# EAGLE design AeroQuad_v20 (EAGLE 5.07)
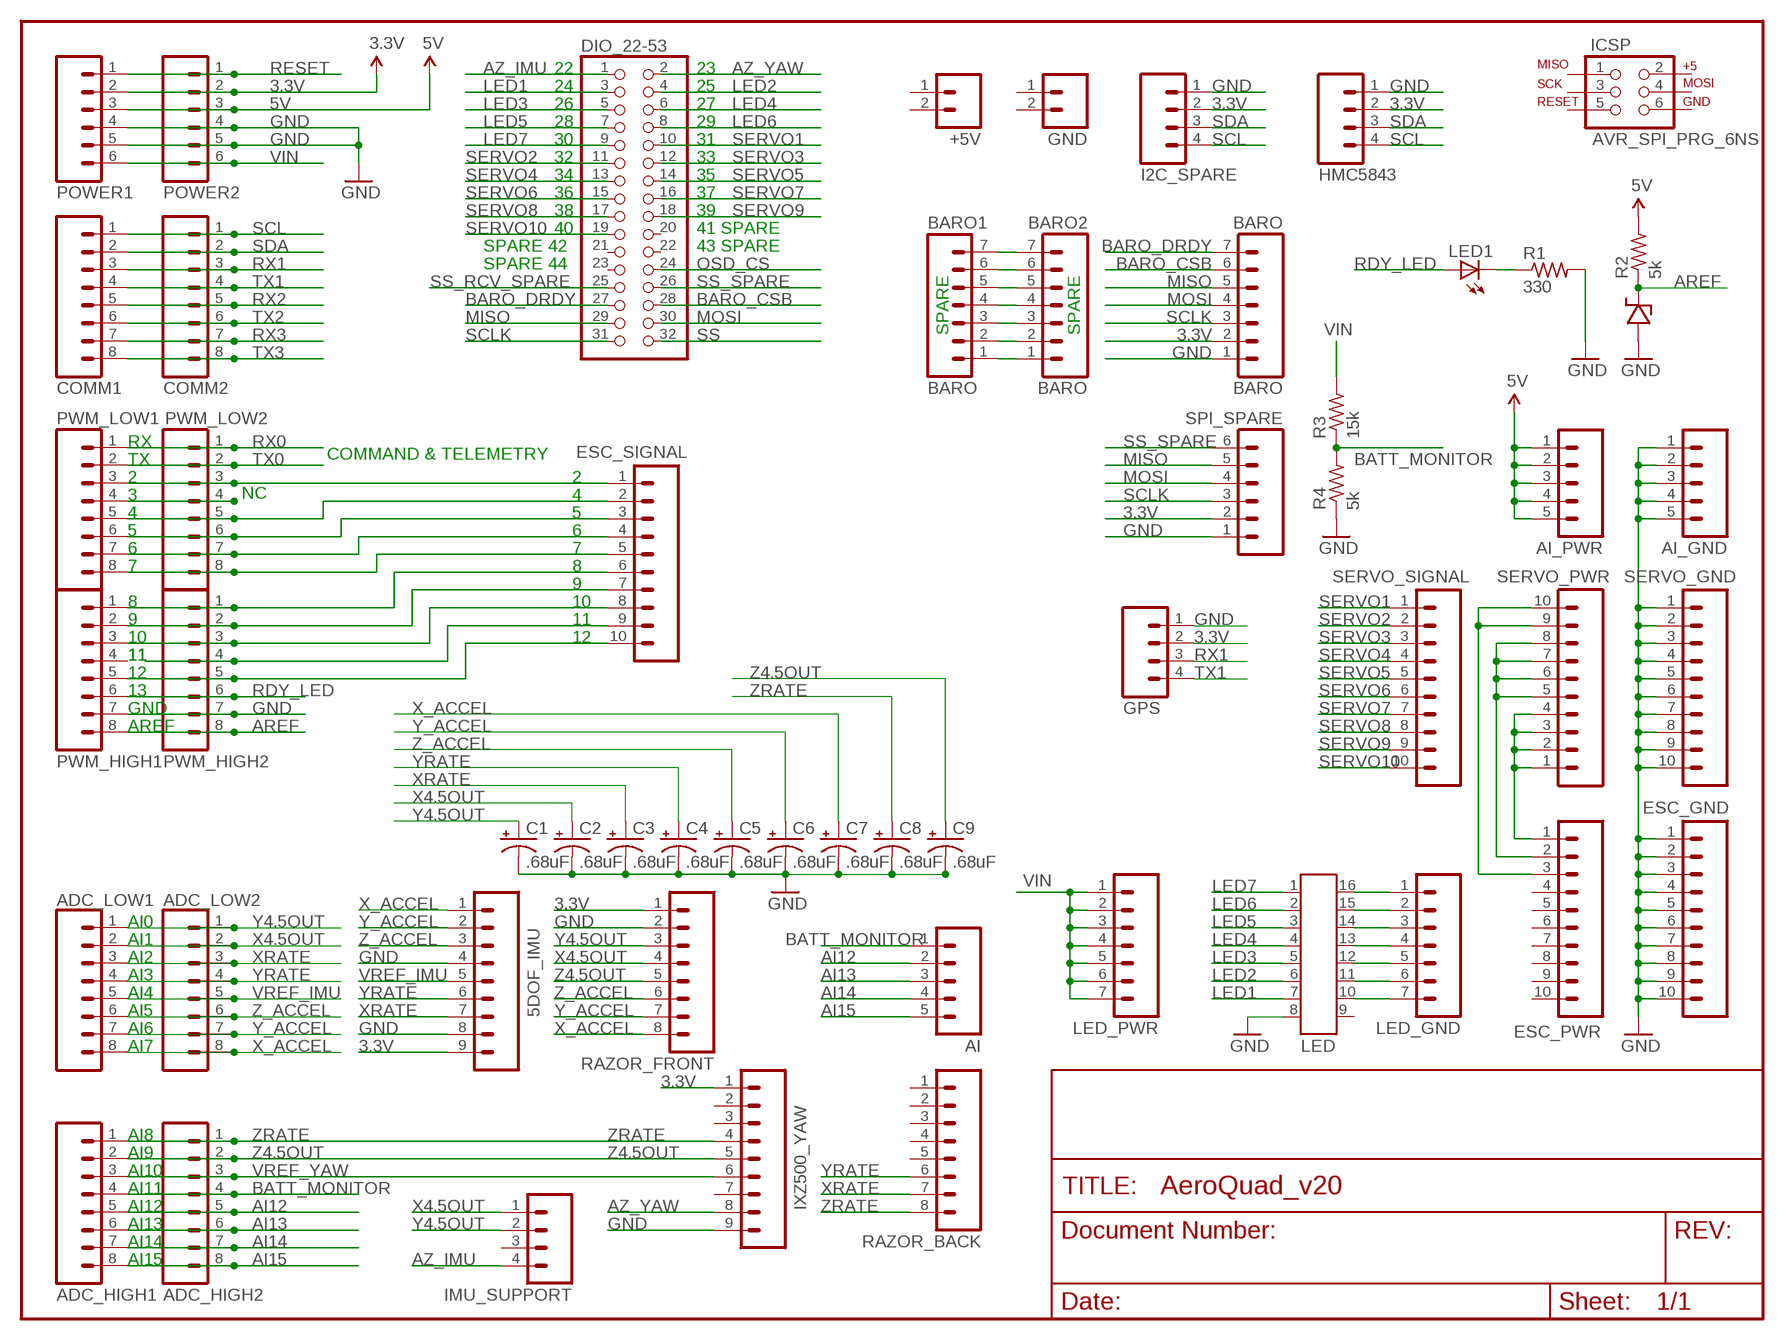
[diagram p0: schematic, sheet 1]

## Parts
5DOF_IMU  M09LOCK  [1X09_LOCK]
+5V  M02PTH  [1X02]
ADC_HIGH1  M08LOCK  [1X08_LOCK]
ADC_HIGH2  M08LOCK  [1X08_LOCK]
ADC_LOW1  M08LOCK  [1X08_LOCK]
ADC_LOW2  M08LOCK  [1X08_LOCK]
AI  M05LOCK  [1X05_LOCK]
AI_GND  M05LOCK  [1X05_LOCK]
AI_PWR  M05LOCK  [1X05_LOCK]
BARO  BARO  M07LOCK  [1X07_LOCK]
BARO1  BARO  M07LOCK  [1X07_LOCK]
BARO2  BARO  M07LOCK  [1X07_LOCK]
C1  .68uF  CAP_POLPTH2  [CPOL-RADIAL-10UF-25V]
C2  .68uF  CAP_POLPTH2  [CPOL-RADIAL-10UF-25V]
C3  .68uF  CAP_POLPTH2  [CPOL-RADIAL-10UF-25V]
C4  .68uF  CAP_POLPTH2  [CPOL-RADIAL-10UF-25V]
C5  .68uF  CAP_POLPTH2  [CPOL-RADIAL-10UF-25V]
C6  .68uF  CAP_POLPTH2  [CPOL-RADIAL-10UF-25V]
C7  .68uF  CAP_POLPTH2  [CPOL-RADIAL-10UF-25V]
C8  .68uF  CAP_POLPTH2  [CPOL-RADIAL-10UF-25V]
C9  .68uF  CAP_POLPTH2  [CPOL-RADIAL-10UF-25V]
COMM1  M08LOCK  [1X08_LOCK]
COMM2  M08LOCK  [1X08_LOCK]
DIO_22-53  PINHD-2X16  [2X16]
ESC_GND  M10LOCK  [1X10_LOCK]
ESC_PWR  M10LOCK  [1X10_LOCK]
ESC_SIGNAL  M10LOCK  [1X10_LOCK]
GND  M02PTH  [1X02]
GPS  M04LOCK  [1X04_LOCK]
HMC5843  M04LOCK  [1X04_LOCK]
I2C_SPARE  M04LOCK  [1X04_LOCK]
ICSP  AVR_SPI_PRG_6NS  [2X3-NS]
IMU_SUPPORT  M04LOCK  [1X04_LOCK]
IXZ500_YAW  M09LOCK  [1X09_LOCK]
LED  ULN2003A  [DIL16]
LED1  LED5MM  [LED5MM]
LED_GND  M07LOCK  [1X07_LOCK]
LED_PWR  M07LOCK  [1X07_LOCK]
POWER1  M06LOCK  [1X06_LOCK]
POWER2  M06LOCK  [1X06_LOCK]
PWM_HIGH1  M08LOCK  [1X08_LOCK]
PWM_HIGH2  M08LOCK  [1X08_LOCK]
PWM_LOW1  M08LOCK  [1X08_LOCK]
PWM_LOW2  M08LOCK  [1X08_LOCK]
R1  330  R-US_0204/5  [0204/5]
R2  5k  R-US_0204/5  [0204/5]
R3  15k  R-US_0204/5  [0204/5]
R4  5k  R-US_0204/5  [0204/5]
RAZOR_BACK  M08LOCK  [1X08_LOCK]
RAZOR_FRONT  M08LOCK  [1X08_LOCK]
SERVO_GND  M10LOCK  [1X10_LOCK]
SERVO_PWR  M10LOCK  [1X10_LOCK]
SERVO_SIGNAL  M10LOCK  [1X10_LOCK]
SPI_SPARE  M06LOCK  [1X06_LOCK]
U$1  LM4040-3V  [TO-92]

## Nets
3.3V: 5DOF_IMU.9 BARO.2 GPS.2 HMC5843.2 I2C_SPARE.2 IXZ500_YAW.1 POWER1.2 POWER2.2 RAZOR_FRONT.1 SPI_SPARE.2
5V: AI_PWR.1 AI_PWR.2 AI_PWR.3 AI_PWR.4 AI_PWR.5 POWER1.3 POWER2.3 R2.2
AI12: ADC_HIGH1.5 ADC_HIGH2.5 AI.2
AI13: ADC_HIGH1.6 ADC_HIGH2.6 AI.3
AI14: ADC_HIGH1.7 ADC_HIGH2.7 AI.4
AI15: ADC_HIGH1.8 ADC_HIGH2.8 AI.5
AREF: PWM_HIGH1.8 PWM_HIGH2.8 R2.1 U$1.2(CATHODE)
AZ_IMU: DIO_22-53.1 IMU_SUPPORT.4
AZ_YAW: DIO_22-53.2 IXZ500_YAW.8
BARO_CSB: BARO.6 DIO_22-53.28
BARO_DRDY: BARO.7 DIO_22-53.27
BATT_MONITOR: ADC_HIGH1.4 ADC_HIGH2.4 AI.1 R3.1 R4.2
GND: 5DOF_IMU.4 5DOF_IMU.8 AI_GND.1 AI_GND.2 AI_GND.3 AI_GND.4 AI_GND.5 BARO.1 C1.2(-) C2.2(-) C3.2(-) C4.2(-) C5.2(-) C6.2(-) C7.2(-) C8.2(-) C9.2(-) ESC_GND.1 ESC_GND.2 ESC_GND.3 ESC_GND.4 ESC_GND.5 ESC_GND.6 ESC_GND.7 ESC_GND.8 ESC_GND.9 ESC_GND.10 GPS.1 HMC5843.1 I2C_SPARE.1 IXZ500_YAW.9 LED.8 POWER1.4 POWER1.5 POWER2.4 POWER2.5 PWM_HIGH1.7 PWM_HIGH2.7 R1.2 R4.1 RAZOR_FRONT.2 SERVO_GND.1 SERVO_GND.2 SERVO_GND.3 SERVO_GND.4 SERVO_GND.5 SERVO_GND.6 SERVO_GND.7 SERVO_GND.8 SERVO_GND.9 SERVO_GND.10 SPI_SPARE.1 U$1.1(ANODE)
LED1: DIO_22-53.3 LED.7
LED2: DIO_22-53.4 LED.6
LED3: DIO_22-53.5 LED.5
LED4: DIO_22-53.6 LED.4
LED5: DIO_22-53.7 LED.3
LED6: DIO_22-53.8 LED.2
LED7: DIO_22-53.9 LED.1
MISO: BARO.5 DIO_22-53.29 SPI_SPARE.5
MOSI: BARO.4 DIO_22-53.30 SPI_SPARE.4
N$5: PWM_LOW1.4 PWM_LOW2.4
N$6: BARO1.7 BARO2.7
N$7: BARO1.6 BARO2.6
N$8: BARO1.5 BARO2.5
N$9: BARO1.4 BARO2.4
N$10: LED.10 LED_GND.7
N$11: LED.11 LED_GND.6
N$12: LED.12 LED_GND.5
N$13: LED.13 LED_GND.4
N$14: LED.14 LED_GND.3
N$15: ESC_SIGNAL.2 PWM_LOW1.5 PWM_LOW2.5
N$16: ESC_SIGNAL.3 PWM_LOW1.6 PWM_LOW2.6
N$17: LED.15 LED_GND.2
N$18: BARO1.3 BARO2.3
N$19: BARO1.2 BARO2.2
N$20: BARO1.1 BARO2.1
N$21: ESC_SIGNAL.1 PWM_LOW1.3 PWM_LOW2.3
N$22: LED1.K(C) R1.1
N$23: ESC_SIGNAL.4 PWM_LOW1.7 PWM_LOW2.7
N$24: ESC_SIGNAL.5 PWM_LOW1.8 PWM_LOW2.8
N$25: ESC_SIGNAL.6 PWM_HIGH1.1 PWM_HIGH2.1
N$26: ESC_SIGNAL.7 PWM_HIGH1.2 PWM_HIGH2.2
N$27: ESC_SIGNAL.8 PWM_HIGH1.3 PWM_HIGH2.3
N$28: ESC_SIGNAL.9 PWM_HIGH2.4
N$29: ESC_SIGNAL.10 PWM_HIGH1.5 PWM_HIGH2.5
N$30: ESC_PWR.1 SERVO_PWR.1 SERVO_PWR.2 SERVO_PWR.3 SERVO_PWR.4
N$32: ESC_PWR.2 SERVO_PWR.5 SERVO_PWR.6 SERVO_PWR.7 SERVO_PWR.8
N$33: ESC_PWR.3 SERVO_PWR.9 SERVO_PWR.10
OSD_CS: DIO_22-53.24
P$16: LED.16 LED_GND.1
RDY_LED: LED1.A PWM_HIGH1.6 PWM_HIGH2.6
RESET: POWER1.1 POWER2.1
RX0: PWM_LOW1.1 PWM_LOW2.1
RX1: COMM1.3 COMM2.3 GPS.3
RX2: COMM1.5 COMM2.5
RX3: COMM1.7 COMM2.7
SCL: COMM1.1 COMM2.1 HMC5843.4 I2C_SPARE.4
SCLK: BARO.3 DIO_22-53.31 SPI_SPARE.3
SDA: COMM1.2 COMM2.2 HMC5843.3 I2C_SPARE.3
SERVO1: DIO_22-53.10 SERVO_SIGNAL.1
SERVO2: DIO_22-53.11 SERVO_SIGNAL.2
SERVO3: DIO_22-53.12 SERVO_SIGNAL.3
SERVO4: DIO_22-53.13 SERVO_SIGNAL.4
SERVO5: DIO_22-53.14 SERVO_SIGNAL.5
SERVO6: DIO_22-53.15 SERVO_SIGNAL.6
SERVO7: DIO_22-53.16 SERVO_SIGNAL.7
SERVO8: DIO_22-53.17 SERVO_SIGNAL.8
SERVO9: DIO_22-53.18 SERVO_SIGNAL.9
SERVO10: DIO_22-53.19 SERVO_SIGNAL.10
SS: DIO_22-53.32
SS_RCV_SPARE: DIO_22-53.25
SS_SPARE: DIO_22-53.26 SPI_SPARE.6
TX0: PWM_LOW1.2 PWM_LOW2.2
TX1: COMM1.4 COMM2.4 GPS.4
TX2: COMM1.6 COMM2.6
TX3: COMM1.8 COMM2.8
VIN: LED_PWR.1 LED_PWR.2 LED_PWR.3 LED_PWR.4 LED_PWR.5 LED_PWR.6 LED_PWR.7 POWER1.6 POWER2.6 R3.2
VREF_IMU: 5DOF_IMU.5 ADC_LOW1.5 ADC_LOW2.5
VREF_YAW: ADC_HIGH1.3 ADC_HIGH2.3 IXZ500_YAW.6
X4.5OUT: ADC_LOW1.2 ADC_LOW2.2 C2.1(+) IMU_SUPPORT.1 RAZOR_FRONT.4
X_ACCEL: 5DOF_IMU.1 ADC_LOW1.8 ADC_LOW2.8 C7.1(+) RAZOR_FRONT.8
XRATE: 5DOF_IMU.7 ADC_LOW1.3 ADC_LOW2.3 C3.1(+) RAZOR_BACK.7
Y4.5OUT: ADC_LOW1.1 ADC_LOW2.1 C1.1(+) IMU_SUPPORT.2 RAZOR_FRONT.3
Y_ACCEL: 5DOF_IMU.2 ADC_LOW1.7 ADC_LOW2.7 C6.1(+) RAZOR_FRONT.7
YRATE: 5DOF_IMU.6 ADC_LOW1.4 ADC_LOW2.4 C4.1(+) RAZOR_BACK.6
Z4.5OUT: ADC_HIGH1.2 ADC_HIGH2.2 C9.1(+) IXZ500_YAW.5 RAZOR_FRONT.5
Z_ACCEL: 5DOF_IMU.3 ADC_LOW1.6 ADC_LOW2.6 C5.1(+) RAZOR_FRONT.6
ZRATE: ADC_HIGH1.1 ADC_HIGH2.1 C8.1(+) IXZ500_YAW.4 RAZOR_BACK.8
Unconnected: +5V.1 +5V.2 DIO_22-53.20 DIO_22-53.21 DIO_22-53.22 DIO_22-53.23 ESC_PWR.4 ESC_PWR.5 ESC_PWR.6 ESC_PWR.7 ESC_PWR.8 ESC_PWR.9 ESC_PWR.10 GND.1 GND.2 ICSP.1 ICSP.2 ICSP.3 ICSP.4 ICSP.5 ICSP.6 IMU_SUPPORT.3 IXZ500_YAW.2 IXZ500_YAW.3 IXZ500_YAW.7 LED.9 PWM_HIGH1.4 RAZOR_BACK.1 RAZOR_BACK.2 RAZOR_BACK.3 RAZOR_BACK.4 RAZOR_BACK.5 U$1.3(NC)

## Notes on the sheet
- 22 | 23
- 24 | 25
- 26 | 27
- 28 | 29
- 30 | 31
- 32 | 33
- 34 | 35
- 36 | 37
- 38 | 39
- 40 | 41 SPARE
- SPARE 42 | 43 SPARE
- SPARE 44
- SPARE | SPARE
- RX
- COMMAND & TELEMETRY
- TX
- 2 | 2
- 3 | NC | 4
- 4 | 5
- 5 | 6
- 6 | 7
- 7 | 8
- 9
- 8 | 10
- 9 | 11
- 10 | 12
- 11 | 11
- 12
- 13
- GND
- AREF
- AI0
- AI1
- AI2
- AI3
- AI4
- AI5
- AI6
- AI7
- AI8
- AI9
- AI10
- AI11
- AI12
- AI13
- AI14
- AI15

## Library data of the parts
5DOF_IMU IXZ500_YAW = SparkFun:M09: Header 9 Standard 9-pin 0.1" header. Use with straight break away headers (SKU : PRT-00116), right angle break away headers (PRT-00553), swiss pins (PRT-00743), machine pins (PRT-00117), and female headers (PRT-00115).
+5V GND = SparkFun:M02: Header 2 Standard 2-pin 0.1" header. Use with straight break away headers (SKU : PRT-00116), right angle break away headers (PRT-00553), swiss pins (PRT-00743), machine pins (PRT-00117), and female headers (PRT-00115). Molex polarized connector foot print use with SKU : PRT-08233 with associated crimp pins and housings.
ADC_HIGH1 ADC_HIGH2 ADC_LOW1 ADC_LOW2 COMM1 COMM2 PWM_HIGH1 PWM_HIGH2 PWM_LOW1 PWM_LOW2 RAZOR_BACK RAZOR_FRONT = SparkFun:M08: Header 8 Standard 8-pin 0.1" header. Use with straight break away headers (SKU : PRT-00116), right angle break away headers (PRT-00553), swiss pins (PRT-00743), machine pins (PRT-00117), and female headers (PRT-00115).
AI AI_GND AI_PWR = SparkFun:M05: Header 5 Standard 5-pin 0.1" header. Use with straight break away headers (SKU : PRT-00116), right angle break away headers (PRT-00553), swiss pins (PRT-00743), machine pins (PRT-00117), and female headers (PRT-00115). Molex polarized connector foot print use with SKU : PRT-08230 with associated crimp pins and housings.
BARO BARO1 BARO2 LED_GND LED_PWR = SparkFun:M07: Header 7 Standard 7-pin 0.1" header. Use with straight break away headers (SKU : PRT-00116), right angle break away headers (PRT-00553), swiss pins (PRT-00743), machine pins (PRT-00117), and female headers (PRT-00115). NOTES ON THE VARIANTS LOCK and LOCK_LONGPADS... This footprint was designed to help hold the alignment of a through-hole component (i.e. 7-pin header) while soldering it into place. You may notice that each hole has been shifted either up or down by 0.005 of an inch from it's more standard position (which is usually a perfectly straight line). This slight alteration caused the pins (the squares in the middle) to touch the edges of the holes. Because they are alternating, it causes a "brace" to hold the header in place. 0.005 has proven to be the perfect amount of "off-center" position when using our standard breakaway headers. Although looks a little odd when you look at the bare footprint, once you have a header in there, the alteration is very hard to notice. Also, if you push a header all the way into place, it is covered up entirely on the bottom side. This idea of altering the position of holes to aid alignment will be further integrated into the Sparkfun Library for other footprints. It can help hold any component with 3 or more connection pins.
C1-C9 = SparkFun:CAP_POL: Capacitor Polarized These are standard SMD and PTH capacitors. Normally 10uF, 47uF, and 100uF in electrolytic and tantalum varieties. Always verify the external diameter of the through hole cap, it varies with capacity, voltage, and manufacturer. The EIA devices should be standard.
DIO_22-53 = pinhead:PINHD-2X16: PIN HEADER
ESC_GND ESC_PWR ESC_SIGNAL SERVO_GND SERVO_PWR SERVO_SIGNAL = SparkFun:M10: Header 10 Standard 10-pin 0.1" header. Use with straight break away headers (SKU : PRT-00116), right angle break away headers (PRT-00553), swiss pins (PRT-00743), machine pins (PRT-00117), and female headers (PRT-00115).
GPS HMC5843 I2C_SPARE IMU_SUPPORT = SparkFun:M04: Header 4 Standard 4-pin 0.1" header. Use with straight break away headers (SKU : PRT-00116), right angle break away headers (PRT-00553), swiss pins (PRT-00743), machine pins (PRT-00117), and female headers (PRT-00115). Molex polarized connector foot print use with SKU : PRT-08231 with associated crimp pins and housings.
ICSP = SparkFun:AVR_SPI_PRG_6: AVR ISP 6 Pin This is the reduced ISP connector for AVR programming. Common on Arduino. This footprint will take up less PCB space and can be used with a 10-pin to 6-pin adapter such as SKU: BOB-08508
LED = CaranchoEngineering:ULN2003: ULN2003A is a high voltage, high current darlington array each containing seven open collector darlington pairs with common emitters.
LED1 = SparkFun:LED: LEDs Standard schematic elements and footprints for 5mm, 3mm, 1206, and 0603 sized LEDs. 5mm - Spark Fun Electronics SKU : COM-00529 (and others)
POWER1 POWER2 SPI_SPARE = SparkFun:M06: Header 6 Standard 6-pin 0.1" header. Use with straight break away headers (SKU : PRT-00116), right angle break away headers (PRT-00553), swiss pins (PRT-00743), machine pins (PRT-00117), and female headers (PRT-00115). Molex polarized connector foot print use with SKU : PRT-08094 with associated crimp pins and housings. NOTES ON THE VARIANTS LOCK and LOCK_LONGPADS... This footprint was designed to help hold the alignment of a through-hole component (i.e. 6-pin header) while soldering it into place. You may notice that each hole has been shifted either up or down by 0.005 of an inch from it's more standard position (which is a perfectly straight line). This slight alteration caused the pins (the squares in the middle) to touch the edges of the holes. Because they are alternating, it causes a "brace" to hold the component in place. 0.005 has proven to be the perfect amount of "off-center" position when using our standard breakaway headers. Although looks a little odd when you look at the bare footprint, once you have a header in there, the alteration is very hard to notice. Also, if you push a header all the way into place, it is covered up entirely on the bottom side. This idea of altering the position of holes to aid alignment will be further integrated into the Sparkfun Library for other footprints. It can help hold any component with 3 or more connection pins.
R1-R4 = resistor:R-US_: RESISTOR, American symbol
U$1 = CaranchoEngineering:LM4040: The LM4040 series of shunt voltage references are versatile, easy-to-use references that cater to a vast array of applications. The 2-pin fixed-output device requires no external capacitors for operation and is stable with all capacitive loads. Additionally, the reference offers low dynamic impedance, low noise, and low temperature coefficient to ensure a stable output voltage over a wide range of operating currents and temperatures.

## Board
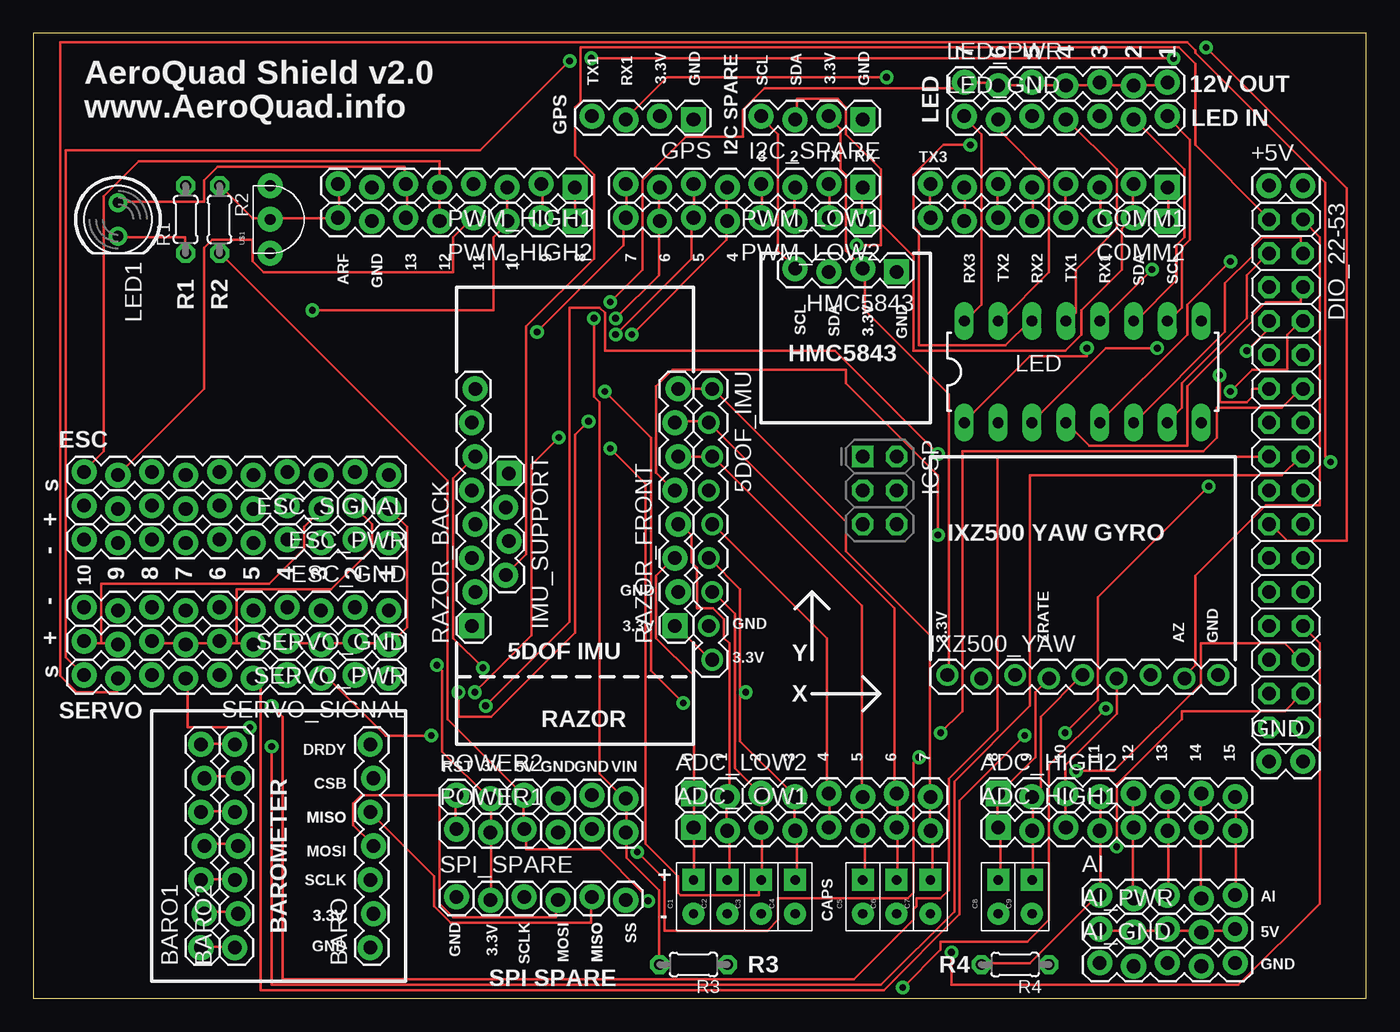
[diagram p1: board, top side]
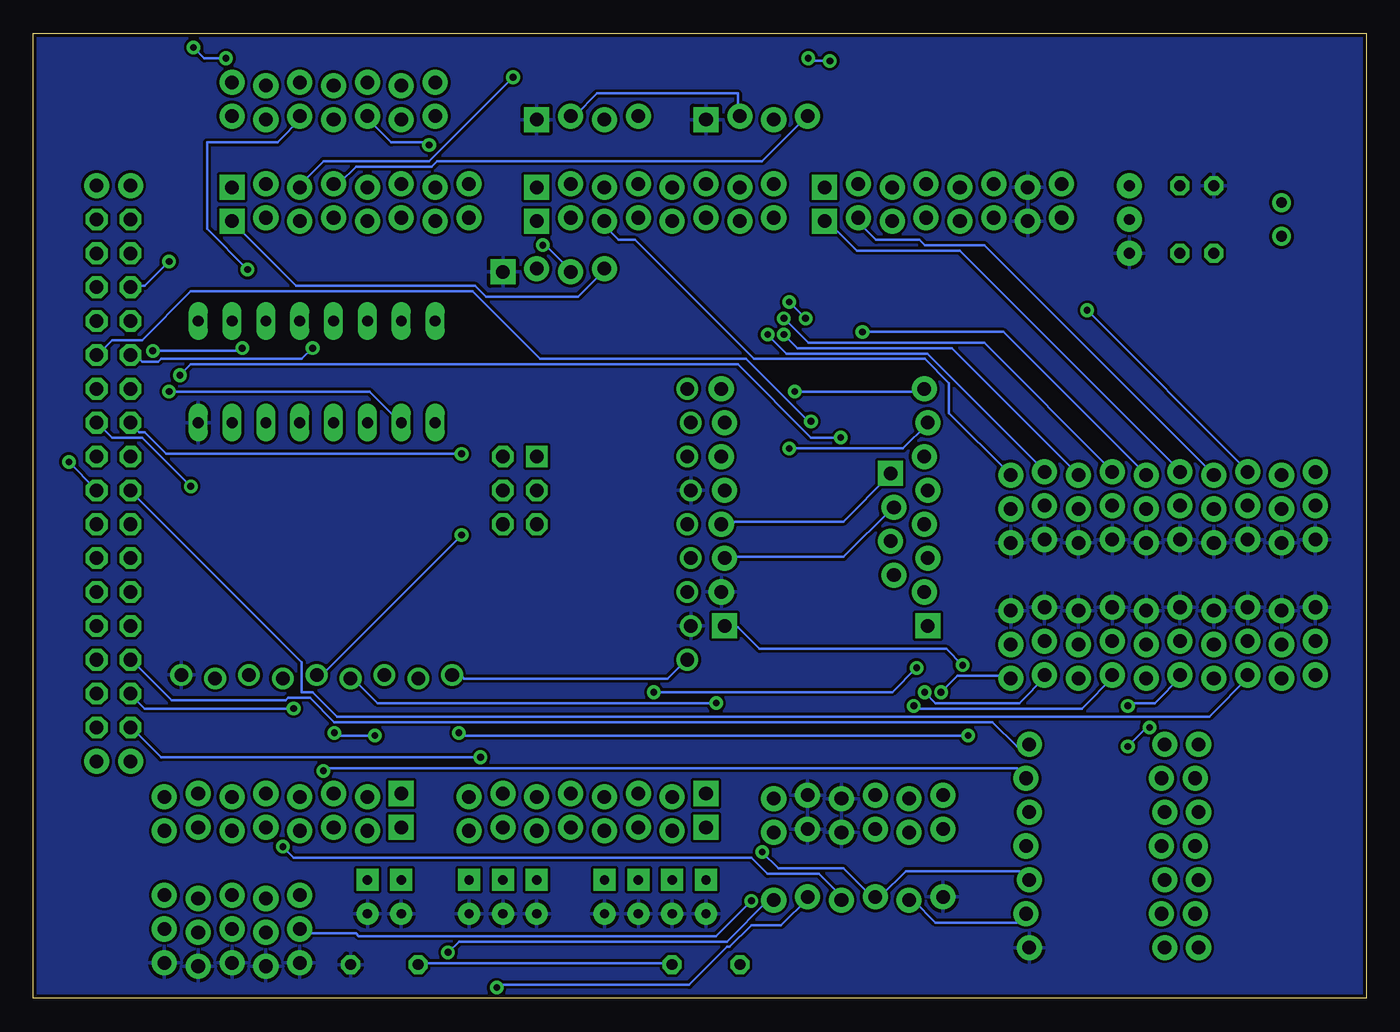
[diagram p2: board, bottom side, seen from below]

Size 100 x 72.38 mm. Coordinates in mm from the lower left corner, seen from the top.
Outline: 0,0 100,0 100,72.38 0,72.38 0,0
Copper layers (1*16): Top 0.035mm / dielectric 1.5mm / Bottom 0.035mm
Design rules "SparkFun": minimum track width 8mil, minimum drill 20mil, track to track 8mil, track to pad 8mil, pad to pad 8mil, via to via 8mil, smd to smd 8mil, copper to edge 10mil, drill to drill 8mil, minimum pad ring 12mil, minimum via ring 10mil, stop-mask expansion 4mil, vias tented up to drill 25mil, thermal gap 10mil

### Footprints (pad centres in the part's own frame; a part is rotated, then mirrored left to right if it is on the bottom)
1X09_LOCK = drill 1.016 round: 1 0,0.127; 2 2.54,-0.127; 3 5.08,0.127; 4 7.62,-0.127; 5 10.16,0.127; 6 12.7,-0.127; 7 15.24,0.127; 8 17.78,-0.127; 9 20.32,0.127
1X02 = drill 1.016 pad 1.88 round: 1 0,0; 2 2.54,0
1X08_LOCK = drill 1.016 pad 1.88 square: 1 0,0.127 | drill 1.016 pad 1.88 round: 2 2.54,-0.127; 3 5.08,0.127; 4 7.62,-0.127; 5 10.16,0.127; 6 12.7,-0.127; 7 15.24,0.127; 8 17.78,-0.127
1X05_LOCK = drill 1.016 pad 1.88 round: 1 0,0.127; 2 2.54,-0.127; 3 5.08,0.127; 4 7.62,-0.127; 5 10.16,0.127
1X07_LOCK = drill 1.016 pad 1.88 round: 1 0,0.127; 2 2.54,-0.127; 3 5.08,0.127; 4 7.62,-0.127; 5 10.16,0.127; 6 12.7,-0.127; 7 15.24,0.127
CPOL-RADIAL-10UF-25V = drill 0.7 pad 1.651 square: 1 1.27,0 | drill 0.7 pad 1.651 round: 2 -1.27,0
2X16 = drill 1.016 octagon: 1 -19.05,-1.27; 2 -19.05,1.27; 3 -16.51,-1.27; 4 -16.51,1.27; 5 -13.97,-1.27; 6 -13.97,1.27; 7 -11.43,-1.27; 8 -11.43,1.27; 9 -8.89,-1.27; 10 -8.89,1.27; 11 -6.35,-1.27; 12 -6.35,1.27; 13 -3.81,-1.27; 14 -3.81,1.27; 15 -1.27,-1.27; 16 -1.27,1.27; 17 1.27,-1.27; 18 1.27,1.27; 19 3.81,-1.27; 20 3.81,1.27; 21 6.35,-1.27; 22 6.35,1.27; 23 8.89,-1.27; 24 8.89,1.27; 25 11.43,-1.27; 26 11.43,1.27; 27 13.97,-1.27; 28 13.97,1.27; 29 16.51,-1.27; 30 16.51,1.27; 31 19.05,-1.27; 32 19.05,1.27
1X10_LOCK = drill 1.016 pad 1.88 round: 1 0,0.127; 2 2.54,-0.127; 3 5.08,0.127; 4 7.62,-0.127; 5 10.16,0.127; 6 12.7,-0.127; 7 15.24,0.127; 8 17.78,-0.127; 9 20.32,0.127; 10 22.86,-0.127
1X04_LOCK = drill 1.016 pad 1.88 square: 1 0,0.127 | drill 1.016 pad 1.88 round: 2 2.54,-0.127; 3 5.08,0.127; 4 7.62,-0.127
2X3-NS = drill 1.016 square: 1 -2.54,-1.27 | drill 1.016 octagon: 2 -2.54,1.27; 3 0,-1.27; 4 0,1.27; 5 2.54,-1.27; 6 2.54,1.27
DIL16 = drill 0.813 long: 1 -8.89,-3.81; 2 -6.35,-3.81; 3 -3.81,-3.81; 4 -1.27,-3.81; 5 1.27,-3.81; 6 3.81,-3.81; 7 6.35,-3.81; 8 8.89,-3.81; 9 8.89,3.81; 10 6.35,3.81; 11 3.81,3.81; 12 1.27,3.81; 13 -1.27,3.81; 14 -3.81,3.81; 15 -6.35,3.81; 16 -8.89,3.81
LED5MM = drill 0.813 round: A -1.27,0; K 1.27,0
1X06_LOCK = drill 1.016 pad 1.88 round: 1 0,0; 2 2.54,-0.254; 3 5.08,0; 4 7.62,-0.254; 5 10.16,0; 6 12.7,-0.254
0204/5 = drill 0.813 octagon: 1 -2.54,0; 2 2.54,0
TO-92 = drill 0.813 pad 1.88 round: 1 -2.54,0; 2 0,0; 3 2.54,0

### Placement (x,y rotation side)
5DOF_IMU  50.8,45.72 270 top
+5V  92.71,60.96 0 top
ADC_HIGH1  72.39,12.7 0 top
ADC_HIGH2  72.39,15.24 0 top
ADC_LOW1  49.53,12.7 0 top
ADC_LOW2  49.53,15.24 0 top
AI  80.01,7.62 0 top
AI_GND  80.01,2.54 0 top
AI_PWR  80.01,5.08 0 top
BARO  25.4,3.81 90 top
BARO1  12.7,3.81 90 top
BARO2  15.24,3.81 90 top
C1  49.53,7.62 90 top
C2  52.07,7.62 90 top
C3  54.61,7.62 90 top
C4  57.15,7.62 90 top
C5  62.23,7.62 90 top
C6  64.77,7.62 90 top
C7  67.31,7.62 90 top
C8  72.39,7.62 90 top
C9  74.93,7.62 90 top
COMM1  85.09,60.96 180 top
COMM2  85.09,58.42 180 top
DIO_22-53  93.98,39.37 270 top
ESC_GND  26.67,34.29 180 top
ESC_PWR  26.67,36.83 180 top
ESC_SIGNAL  26.67,39.37 180 top
GND  92.71,17.78 0 top
GPS  49.53,66.04 180 top
HMC5843  64.77,54.61 180 top
I2C_SPARE  62.23,66.04 180 top
ICSP  63.5,38.1 270 top
IMU_SUPPORT  35.56,39.37 270 top
IXZ500_YAW  68.58,24.13 0 top
LED  78.74,46.99 0 top
LED1  6.35,58.42 270 top
LED_GND  69.85,66.04 0 top
LED_PWR  69.85,68.58 0 top
POWER1  31.75,12.7 0 top
POWER2  31.75,15.24 0 top
PWM_HIGH1  40.64,60.96 180 top
PWM_HIGH2  40.64,58.42 180 top
PWM_LOW1  62.23,60.96 180 top
PWM_LOW2  62.23,58.42 180 top
R1  11.43,58.42 90 top
R2  13.97,58.42 270 top
R3  49.53,2.54 180 top
R4  73.66,2.54 180 top
RAZOR_BACK  33.02,27.94 90 top
RAZOR_FRONT  48.26,27.94 90 top
SERVO_GND  26.67,29.21 180 top
SERVO_PWR  26.67,26.67 180 top
SERVO_SIGNAL  26.67,24.13 180 top
SPI_SPARE  31.75,7.62 0 top
U$1  17.78,58.42 90 top

### Tracks (layer width: path | path; a pad name or v marks a point on that pad's centre or on a via)
3.3V  (via drill 0.51)
  Top 0.203: SPI_SPARE.2 34.34,7.52 34.34,12.39 POWER1.2 34.34,12.6 34.34,14.83 POWER2.2 34.14,15.04 30.68,18.49 30.68,24.59 v30.28,24.99 | 5DOF_IMU.9 50.8,25.4 48.16,28.04 RAZOR_FRONT.1 | IXZ500_YAW.1 68.68,24.38 68.68,45.31 62.38,51.61 62.38,54.66 HMC5843.2 62.18,54.86 60.96,56.08 60.96,61.77 60.55,62.18 60.55,65.23 59.74,66.04 I2C_SPARE.2
  Bottom 0.203: BARO.2 25.6,6.3 26.21,5.69 32.31,5.69 33.93,7.32 34.14,7.32 SPI_SPARE.2 | GPS.2 47.14,66.24 47.14,67.87 57.71,67.87 59.33,66.24 59.54,66.24 I2C_SPARE.2 | 5DOF_IMU.9 51,25.4 52.43,23.98 67.67,23.98 67.87,24.18 68.48,24.18 IXZ500_YAW.1 | v30.28,24.99 31.5,26.21 45.52,26.21 47.14,27.84 47.95,27.84 RAZOR_FRONT.1
5V  (via drill 0.51)
  Top 0.203: AI_PWR.5 90.02,5.08 87.78,5.08 AI_PWR.4 87.58,5.08 85.14,5.08 AI_PWR.3 84.94,5.08 82.7,5.08 AI_PWR.2 82.5,5.08 80.06,5.08 AI_PWR.1 | 36.78,15.24 31.09,20.93 31.09,38.81 14.02,55.88 R2.2 | 36.78,15.24 36.78,12.8 POWER1.3 36.98,12.6 36.98,11.18 42.47,11.18 45.72,7.92 45.72,7.72 v46.13,7.32 | 36.78,15.24 POWER2.3
  Bottom 0.203: v46.13,7.32 48.77,4.67 75.59,4.67 75.79,4.88 79.65,4.88 79.86,5.08 AI_PWR.1
AI12
  Top 0.203: AI.2 82.5,7.52 82.5,12.8 ADC_HIGH1.5 82.5,13.01 82.5,15.24 ADC_HIGH2.5
AI13
  Top 0.203: AI.3 85.14,7.92 85.14,12.39 ADC_HIGH1.6 85.14,12.6 85.14,15.04 ADC_HIGH2.6
AI14
  Top 0.203: AI.4 87.58,7.52 87.58,12.8 ADC_HIGH1.7 87.58,13.01 87.58,15.24 ADC_HIGH2.7
AI15
  Top 0.203: AI.5 90.22,7.92 90.22,12.39 ADC_HIGH1.8 90.22,12.6 90.22,15.04 ADC_HIGH2.8
AREF
  Top 0.203: PWM_HIGH1.8 22.96,60.96 22.96,58.73 PWM_HIGH2.8 22.76,58.52 17.88,58.52 U$1.2 17.68,58.52 16.46,58.52 14.02,60.96 R2.1
AZ_IMU
  Top 0.203: DIO_22-53.1 92.66,58.52 87.17,64.01 87.17,70.1 85.95,71.32 41.05,71.32 41.05,67.26 40.64,66.85 40.64,63.2 42.06,61.77 42.06,55.47 36.98,50.39 36.98,33.33 35.56,31.9 IMU_SUPPORT.4
AZ_YAW
  Top 0.203: IXZ500_YAW.8 86.36,24.18 87.17,24.99 87.17,31.7 92.46,36.98 96.52,36.98 96.52,57.1 95.3,58.32 DIO_22-53.2
BARO_CSB  (via drill 0.51)
  Top 0.203: v78.23,17.07 81.08,17.07 87.58,23.57 87.58,26.62 93.88,26.62 95.1,25.4 DIO_22-53.28
  Bottom 0.203: v78.23,17.07 78.03,17.27 26.21,17.27 25.6,16.66 BARO.6
BARO_DRDY
  Bottom 0.203: DIO_22-53.27 92.66,25.4 89.61,22.35 81.08,22.35 80.87,22.55 79.25,22.55 77.42,20.73 28.04,20.73 26.21,18.9 25.4,18.9 BARO.7
BATT_MONITOR
  Top 0.203: ADC_HIGH2.4 80.06,15.04 80.06,12.6 ADC_HIGH1.4 80.06,12.39 80.06,7.92 AI.1 79.86,7.72 74.78,2.64 71.12,2.64 R4.2
  Bottom 0.203: R3.1 52.22,2.64 71.12,2.64 R4.2
GND
  pour Bottom: 0,0 0,72.39 100.33,72.39 100.33,0
LED1
  Top 0.203: LED.7 85.14,43.28 86.16,44.3 86.16,46.13 91.03,51 91.03,54.25 92.66,55.88 DIO_22-53.3
LED2
  Top 0.203: LED.6 82.7,43.28 89.41,49.99 89.41,53.65 91.44,55.68 91.44,56.29 92.25,57.1 95.1,57.1 95.1,55.88 DIO_22-53.4
LED3  (via drill 0.51)
  Top 0.203: v89.81,55.27 86.56,52.02 86.56,49.78 80.06,43.28 LED.5
  Bottom 0.203: v89.81,55.27 91.64,53.44 92.66,53.44 DIO_22-53.5
LED4
  Top 0.203: LED.4 77.62,43.08 79.25,41.45 86.56,41.45 86.56,45.92 91.44,50.8 91.44,51.21 92.46,52.22 95.1,52.22 95.1,53.24 DIO_22-53.6
LED5  (via drill 0.51)
  Top 0.203: v84.33,48.77 80.47,48.77 74.98,43.28 LED.3 | v91.03,48.56 92.66,50.19 92.66,50.8 DIO_22-53.7
  Bottom 0.203: v84.33,48.77 84.53,48.56 v91.03,48.56
LED6  (via drill 0.51)
  Top 0.203: v89.81,45.52 91.44,47.14 94.08,47.14 94.08,49.78 95.1,50.8 DIO_22-53.8
  Bottom 0.203: v89.81,45.52 74.78,45.52 72.54,43.28 LED.2
LED7  (via drill 0.51)
  Top 0.203: v79.05,48.77 79.05,48.16 74.78,48.16 69.9,43.28 LED.1
  Bottom 0.203: v79.05,48.77 79.86,47.95 90.42,47.95 90.63,47.75 91.85,47.75 92.25,48.16 92.66,48.16 DIO_22-53.9
MISO  (via drill 0.51)
  Top 0.203: v80.47,21.74 76.2,17.48 76.2,5.89 74.57,4.27 68.07,4.27 68.07,3.66 v65.23,0.81 | BARO.5 25.4,13.82 30.07,9.14 30.07,6.91 31.29,5.69 41.86,5.69 41.86,7.52 SPI_SPARE.5
  Bottom 0.203: v80.47,21.74 91.64,21.74 92.66,22.76 DIO_22-53.29 | v65.23,0.81 65.02,1.02 50.8,1.02 47.95,3.86 47.75,3.86 46.13,5.49 43.89,5.49 41.86,7.52 SPI_SPARE.5
MOSI  (via drill 0.51)
  Top 0.203: v81.28,11.38 81.28,16.05 86.16,20.93 86.16,21.54 93.88,21.54 95.1,22.76 DIO_22-53.30 | BARO.4 25.4,11.58 23.98,13.01 23.98,14.63 24.59,15.24 30.48,15.24 30.48,7.11 31.5,6.1 39.22,6.1 39.22,7.32 SPI_SPARE.4
  Bottom 0.203: v81.28,11.38 80.47,10.57 46.13,10.57 44.91,9.35 41.05,9.35 39.22,7.52 SPI_SPARE.4
N$5
  Top 0.203: PWM_LOW2.4 54.66,58.73 54.66,60.96 PWM_LOW1.4
N$6
  Top 0.203: BARO1.7 12.6,19.1 15.04,19.1 BARO2.7
N$7
  Top 0.203: BARO1.6 13.01,16.66 15.24,16.66 BARO2.6
N$8
  Top 0.203: BARO1.5 12.6,14.02 15.04,14.02 BARO2.5
N$9
  Top 0.203: BARO1.4 13.01,11.58 15.24,11.58 BARO2.4
N$10
  Top 0.203: LED.10 85.14,50.8 86.16,51.82 86.16,56.29 86.77,56.9 86.77,64.41 85.14,66.04 LED_GND.7
N$11
  Top 0.203: LED.11 82.7,50.8 85.75,53.85 85.75,56.49 86.36,57.1 86.36,62.18 82.7,65.84 LED_GND.6
N$12  (via drill 0.51)
  Top 0.203: v83.92,54.66 80.06,50.8 LED.12
  Bottom 0.203: v83.92,54.66 86.97,57.71 86.97,64.21 81.69,64.21 79.86,66.04 LED_GND.5
N$13
  Top 0.203: LED.13 77.62,50.8 78.23,51.41 78.23,54.66 81.28,57.71 81.28,62.18 77.62,65.84 LED_GND.4
N$14  (via drill 0.51)
  Top 0.203: v70.31,64.01 68.28,64.01 66.04,61.77 66.04,57.91 66.45,57.51 66.45,48.97 72.95,48.97 74.78,50.8 LED.14
  Bottom 0.203: v70.31,64.01 70.51,64.21 73.15,64.21 74.98,66.04 LED_GND.3
N$15  (via drill 0.51)
  Top 0.203: v44.91,49.78 52.02,56.9 52.02,58.12 PWM_LOW2.5 52.02,58.32 52.02,60.76 PWM_LOW1.5
  Bottom 0.203: v44.91,49.78 43.48,48.36 32.92,48.36 24.18,39.62 ESC_SIGNAL.2
N$16  (via drill 0.51)
  Top 0.203: v43.69,49.78 49.38,55.47 49.38,58.52 PWM_LOW2.6 49.58,58.73 49.58,60.96 PWM_LOW1.6
  Bottom 0.203: v43.69,49.78 42.67,48.77 31.09,48.77 21.74,39.42 ESC_SIGNAL.3
N$17
  Top 0.203: LED.15 72.54,50.8 76.2,54.46 76.2,61.37 72.54,65.02 72.54,65.84 LED_GND.2
N$18
  Top 0.203: BARO1.3 12.6,8.94 15.04,8.94 BARO2.3
N$19
  Top 0.203: BARO1.2 13.01,6.5 15.24,6.5 BARO2.2
N$20
  Top 0.203: BARO1.1 12.6,3.86 15.04,3.86 BARO2.1
N$21
  Top 0.203: PWM_LOW1.3 57.1,60.76 57.1,58.32 PWM_LOW2.3
  Bottom 0.203: ESC_SIGNAL.1 26.82,39.42 31.29,43.89 31.29,46.13 33.12,47.95 45.92,47.95 54.86,56.9 56.08,56.9 57.3,58.12 PWM_LOW2.3
N$22
  Top 0.203: LED1.K 6.5,57.1 11.38,57.1 11.38,55.88 R1.1
N$23  (via drill 0.51)
  Top 0.203: v43.69,51 46.94,54.25 46.94,58.12 PWM_LOW2.7 46.94,58.32 46.94,60.76 PWM_LOW1.7
  Bottom 0.203: v43.69,51 41.86,49.17 28.65,49.17 19.1,39.62 ESC_SIGNAL.4
N$24  (via drill 0.51)
  Top 0.203: v37.8,49.99 44.3,56.49 44.3,58.52 PWM_LOW2.8 44.5,58.73 44.5,60.96 PWM_LOW1.8
  Bottom 0.203: v37.8,49.99 27.23,49.99 16.66,39.42 ESC_SIGNAL.5
N$25
  Top 0.203: PWM_HIGH2.1 PWM_HIGH1.1
  Bottom 0.203: ESC_SIGNAL.6 14.02,39.62 30.48,56.08 38.2,56.08 40.23,58.12 40.64,58.12 PWM_HIGH2.1
N$26
  Top 0.203: PWM_HIGH1.2 38.2,60.96 38.2,58.73 PWM_HIGH2.2
  Bottom 0.203: ESC_SIGNAL.7 11.58,39.42 28.65,56.49 33.12,56.49 33.53,56.9 36.78,56.9 38,58.12 38,58.52 PWM_HIGH2.2
N$27  (via drill 0.51)
  Top 0.203: v20.93,51.61 34.54,51.61 34.54,57.1 35.56,58.12 PWM_HIGH2.3 PWM_HIGH1.3
  Bottom 0.203: v20.93,51.61 8.94,39.62 ESC_SIGNAL.8
N$28
  Top 0.203: ESC_SIGNAL.9 6.5,39.42 12.8,45.72 12.8,56.29 13.41,56.9 16.46,56.9 16.46,55.27 17.27,54.46 31.5,54.46 31.5,57.1 32.92,58.52 PWM_HIGH2.4
N$29
  Top 0.203: ESC_SIGNAL.10 3.86,39.62 5.28,41.05 5.28,60.15 7.92,62.79 30.48,62.79 PWM_HIGH1.5 PWM_HIGH2.5
N$30
  Top 0.203: SERVO_PWR.4 19.1,26.62 21.54,26.62 SERVO_PWR.3 21.74,26.62 23.98,26.62 SERVO_PWR.2 24.18,26.62 26.62,26.62 SERVO_PWR.1 26.82,26.62 28.04,27.84 28.04,35.36 26.82,36.58 ESC_PWR.1
N$32
  Top 0.203: 15.24,26.62 14.02,26.62 SERVO_PWR.6 13.82,26.62 11.58,26.62 SERVO_PWR.7 11.38,26.62 8.94,26.62 SERVO_PWR.8 | 15.24,26.62 16.46,26.62 SERVO_PWR.5 | 15.24,26.62 15.24,30.68 22.35,30.68 25.4,33.73 25.4,35.56 24.18,36.78 ESC_PWR.2
N$33
  Top 0.203: 5.08,26.62 6.3,26.62 SERVO_PWR.9 | 5.08,26.62 3.86,26.62 SERVO_PWR.10 | 5.08,26.62 5.08,31.09 17.68,31.09 20.32,33.73 20.32,35.36 21.54,36.58 ESC_PWR.3
P$16
  Top 0.203: LED.16 69.9,50.8 71.12,52.02 71.12,64.82 69.9,66.04 LED_GND.1
RDY_LED
  Top 0.203: LED1.A 6.5,59.74 12.8,59.74 12.8,61.37 13.82,62.38 27.84,62.38 27.84,61.16 PWM_HIGH1.6 28.04,60.96 28.04,58.73 PWM_HIGH2.6
RESET
  Top 0.203: POWER1.1 31.7,12.8 31.7,15.24 POWER2.1
RX0
  Top 0.203: PWM_LOW2.1 62.18,58.32 62.18,60.76 PWM_LOW1.1
RX1  (via drill 0.51)
  Top 0.203: COMM2.3 80.06,58.32 80.06,60.76 COMM1.3 | v64.01,69.09 47.55,69.09 44.5,66.04 GPS.3
  Bottom 0.203: v64.01,69.09 70.31,62.79 78.23,62.79 80.06,60.96 COMM1.3
RX2
  Top 0.203: COMM2.5 74.98,58.32 74.98,60.76 COMM1.5
RX3
  Top 0.203: COMM2.7 69.9,58.32 69.9,60.76 COMM1.7
SCL
  Top 0.203: COMM2.1 85.14,58.32 85.14,60.76 COMM1.1 | HMC5843.4 57.1,54.86 55.88,56.08 55.88,64.82 54.66,66.04 I2C_SPARE.4
  Bottom 0.203: COMM2.1 84.94,58.12 80.26,53.44 66.85,53.44 66.04,52.63 59.13,52.63 57.1,54.66 HMC5843.4
SCLK  (via drill 0.51)
  Top 0.203: v66.45,18.09 66.04,17.68 66.04,7.92 65.63,7.52 55.88,7.52 55.88,5.89 55.07,5.08 47.35,5.08 47.35,8.94 v45.31,10.97
  Bottom 0.203: v66.45,18.09 90.42,18.09 92.66,20.32 DIO_22-53.31 | v45.31,10.97 44.09,9.75 39.22,9.75 37.19,7.72 36.98,7.72 SPI_SPARE.3 36.78,7.72 36.37,7.72 34.54,9.55 26.01,9.55 25.4,8.94 BARO.3
SDA  (via drill 0.51)
  Top 0.203: COMM1.2 82.5,60.96 82.5,58.73 COMM2.2 82.5,58.52 81.69,57.71 81.69,54.66 78.64,51.61 78.64,49.78 77.42,48.56 66.04,48.56 66.04,55.68 63.6,58.12 | v61.77,56.49 63.6,56.49 63.6,58.12 | 63.6,58.12 63.6,62.18 60.96,64.82 60.96,66.85 60.35,67.46 57.3,67.46 57.3,66.04 I2C_SPARE.3
  Bottom 0.203: v61.77,56.49 61.57,56.49 59.74,54.66 HMC5843.3
SERVO1  (via drill 0.51)
  Top 0.203: v41.66,43.28 40.64,42.27 40.64,27.43 34.34,21.13 31.9,21.13 v31.9,22.96
  Bottom 0.203: v41.66,43.28 41.86,43.28 46.53,47.95 61.98,47.95 67.06,53.03 88.19,53.03 91.85,49.38 94.08,49.38 95.1,48.36 DIO_22-53.10 | v31.9,22.96 30.68,24.18 26.82,24.18 SERVO_SIGNAL.1
SERVO2  (via drill 0.51)
  Top 0.203: v89,46.74 89,44.7 91.03,44.7 91.44,45.11 91.44,45.72 DIO_22-53.11 | v39.42,42.06 37.39,40.03 37.39,27.23 v33.12,22.96
  Bottom 0.203: v89,46.74 88.19,47.55 47.14,47.55 41.66,42.06 v39.42,42.06 | v33.12,22.96 32.31,22.15 26.01,22.15 23.98,24.18 SERVO_SIGNAL.2
SERVO3  (via drill 0.51)
  Top 0.203: v68.07,19.91 69.7,21.54 69.7,41.05 87.78,41.05 88.8,42.06 88.8,44.3 93.67,44.3 95.1,45.72 DIO_22-53.12 | v29.87,19.71 26.42,19.71 22.15,23.98 21.74,23.98 SERVO_SIGNAL.3
  Bottom 0.203: v68.07,19.91 67.87,19.71 v29.87,19.71
SERVO4  (via drill 0.51)
  Top 0.203: v67.87,40.84 60.15,48.56 42.88,48.56 42.88,51.41 42.47,51.82 40.23,51.82 40.23,28.25 v33.93,21.95
  Bottom 0.203: v67.87,40.84 90.02,40.84 91.64,42.47 92.05,42.47 92.66,43.08 DIO_22-53.13 | v33.93,21.95 33.73,21.74 21.34,21.74 18.9,24.18 SERVO_SIGNAL.4
SERVO5  (via drill 0.51)
  Top 0.203: v88.19,38.41 79.86,30.07 79.86,22.35 v77.42,19.91 | v74.37,19.71 69.49,14.83 69.49,6.3 63.8,0.61 17.07,0.61 17.07,23.57 16.66,23.98 SERVO_SIGNAL.5
  Bottom 0.203: v88.19,38.41 91.85,42.06 94.08,42.06 95.1,43.08 DIO_22-53.14 | v77.42,19.91 77.22,19.71 v74.37,19.71
SERVO6  (via drill 0.51)
  Top 0.203: v17.88,21.95 18.69,21.13 18.69,1.42 61.57,1.42 66.04,5.89 66.04,6.71 66.24,6.91 66.24,7.52 68.07,7.52 68.68,8.13 68.68,16.46 72.34,20.12 72.34,40.64 DIO_22-53.15
  Bottom 0.203: v17.88,21.95 17.68,22.15 15.85,22.15 13.82,24.18 SERVO_SIGNAL.6
SERVO7  (via drill 0.51)
  Top 0.203: v17.88,18.9 17.88,1.02 63.6,1.02 69.09,6.5 69.09,16.26 74.78,21.95 74.78,39.22 93.67,39.22 95.1,40.64 DIO_22-53.16 | v16.26,20.32 11.58,20.32 11.58,23.98 SERVO_SIGNAL.7
  Bottom 0.203: v17.88,18.9 16.46,20.32 v16.26,20.32
SERVO8
  Bottom 0.203: DIO_22-53.17 92.66,38 79.86,25.2 79.86,22.96 79.05,22.96 77.22,21.13 11.79,21.13 8.74,24.18 SERVO_SIGNAL.8
SERVO9  (via drill 0.51)
  Top 0.203: v97.33,40.23 96.93,40.64 96.93,61.16 87.17,70.92 87.17,71.12 86.56,71.73 2.03,71.73 2.03,24.18 3.25,22.96 6.3,22.96 6.3,23.98 SERVO_SIGNAL.9
  Bottom 0.203: v97.33,40.23 95.3,38.2 DIO_22-53.18
SERVO10  (via drill 0.51)
  Top 0.203: v87.99,71.32 98.55,60.76 98.55,34.34 94.08,34.34 92.86,35.56 DIO_22-53.19 | v41.86,70.51 v85.55,70.51 | v40.23,70.31 33.53,63.6 2.44,63.6 2.44,25.6 3.66,24.38 SERVO_SIGNAL.10
  Bottom 0.203: v87.99,71.32 87.17,70.51 v85.55,70.51 | v41.86,70.51 41.66,70.31 v40.23,70.31
SS_SPARE  (via drill 0.51)
  Top 0.203: v68.89,3.45 68.89,1.02 90.42,1.02 96.52,7.11 96.52,26.62 95.3,27.84 DIO_22-53.26
  Bottom 0.203: v68.89,3.45 68.07,4.27 47.95,4.27 44.91,7.32 44.5,7.32 SPI_SPARE.6
TX0
  Top 0.203: PWM_LOW2.2 59.74,58.73 59.74,60.96 PWM_LOW1.2
TX1
  Top 0.203: COMM2.4 77.42,58.73 77.42,60.96 COMM1.4
  Bottom 0.203: GPS.4 42.06,66.04 45.31,62.79 69.7,62.79 70.1,62.38 75.79,62.38 77.01,61.16 77.42,61.16 COMM1.4
TX2
  Top 0.203: COMM2.6 72.34,58.73 72.34,60.96 COMM1.6
TX3
  Top 0.203: COMM2.8 67.26,58.73 67.26,60.96 COMM1.8
VIN  (via drill 0.51)
  Top 0.203: R3.2 46.94,2.64 46.94,8.13 44.5,10.57 44.5,12.39 POWER1.6 44.5,12.6 44.5,14.83 POWER2.6 44.3,15.04 42.47,16.87 42.47,44.7 42.06,45.11 v42.06,51 | LED_PWR.7 84.94,68.68 84.94,68.48 82.7,68.48 LED_PWR.6 82.5,68.48 79.86,68.48 | 79.86,68.48 77.62,68.48 LED_PWR.4 77.42,68.48 74.78,68.48 | 79.86,68.48 79.86,68.68 LED_PWR.5 79.86,68.48 | 74.78,68.48 72.54,68.48 LED_PWR.2 72.34,68.48 72.34,68.68 69.9,68.68 LED_PWR.1 69.7,68.68 69.7,68.28 54.86,68.28 53.24,66.65 53.24,64.62 48.97,64.62 45.72,61.37 45.72,54.66 v43.28,52.22 | 74.78,68.48 74.78,68.68 LED_PWR.3 74.78,68.48
  Bottom 0.203: v42.06,51 v43.28,52.22
VREF_IMU
  Top 0.203: 5DOF_IMU.5 51,35.56 59.54,27.03 59.54,15.44 ADC_LOW2.5 59.74,15.24 59.74,13.01 ADC_LOW1.5
VREF_YAW
  Top 0.203: IXZ500_YAW.6 81.28,21.34 77.42,17.48 77.42,15.44 ADC_HIGH2.3 77.42,15.24 77.42,13.01 ADC_HIGH1.3
X4.5OUT
  Top 0.203: C2.1 52.22,8.94 52.22,12.39 ADC_LOW1.2 52.02,12.6 52.02,15.04 ADC_LOW2.2 52.22,15.24 52.22,26.62 51.82,27.03 51.82,28.45 51,29.26 49.78,29.26 49.78,32.31 49.38,32.72 49.38,34.75 48.56,35.56 RAZOR_FRONT.4
  Bottom 0.203: IMU_SUPPORT.1 35.76,39.22 39.22,35.76 47.35,35.76 47.55,35.56 RAZOR_FRONT.4
X_ACCEL
  Top 0.203: RAZOR_FRONT.8 5DOF_IMU.1 51,45.72 60.96,35.76 60.96,33.53 67.26,27.23 67.26,15.24 ADC_LOW2.8 67.26,15.04 67.26,12.6 ADC_LOW1.8 67.46,12.39 67.46,8.94 C7.1
XRATE  (via drill 0.51)
  Top 0.203: 5DOF_IMU.7 51,30.48 52.63,28.85 52.63,17.27 54.46,15.44 ADC_LOW2.3 54.66,15.24 54.66,13.01 ADC_LOW1.3 54.66,12.8 54.66,8.94 C3.1 54.46,8.74 54.46,7.72 48.56,7.72 48.36,7.92 48.36,9.14 45.92,11.58 45.92,38.61 v43.28,41.25
  Bottom 0.203: v43.28,41.25 34.75,41.25 32.92,43.08 RAZOR_BACK.7
Y4.5OUT
  Top 0.203: C1.1 49.58,8.94 49.58,12.8 ADC_LOW1.1 49.58,13.01 49.58,15.24 ADC_LOW2.1 49.58,15.44 49.58,24.18 46.74,27.03 46.74,31.7 47.95,32.92 RAZOR_FRONT.3
  Bottom 0.203: IMU_SUPPORT.2 35.56,36.78 39.22,33.12 47.95,33.12 RAZOR_FRONT.3
Y_ACCEL
  Top 0.203: RAZOR_FRONT.7 48.16,43.28 50.6,43.28 5DOF_IMU.2 50.8,43.08 64.62,29.26 64.62,15.44 ADC_LOW2.7 64.82,15.24 64.82,13.01 ADC_LOW1.7 64.82,12.8 64.82,8.94 C6.1
YRATE  (via drill 0.51)
  Top 0.203: C4.1 57.3,8.94 57.3,12.39 ADC_LOW1.4 57.1,12.6 57.1,15.04 ADC_LOW2.4 57.1,15.24 53.03,19.3 53.03,22.96 | 53.03,22.96 53.03,30.68 50.8,32.92 5DOF_IMU.6 | v33.73,24.79 31.5,27.03 31.5,39.01 33.12,40.64 RAZOR_BACK.6 | v53.44,22.96 53.03,22.96
  Bottom 0.203: v33.73,24.79 35.56,22.96 v53.44,22.96
Z4.5OUT  (via drill 0.51)
  Top 0.203: C9.1 74.98,8.94 74.98,12.39 ADC_HIGH1.2 74.98,12.6 74.98,15.04 ADC_HIGH2.2 74.98,15.24 75.59,15.85 75.59,21.13 78.64,24.18 IXZ500_YAW.5 | v67.87,34.75 67.87,39.22 60.96,46.13 60.96,47.14 47.95,47.14 46.74,45.92 46.74,39.42 47.95,38.2 RAZOR_FRONT.5
  Bottom 0.203: v67.87,34.75 78.23,24.38 78.64,24.38 IXZ500_YAW.5
Z_ACCEL
  Top 0.203: RAZOR_FRONT.6 5DOF_IMU.3 51,40.64 62.18,29.46 62.18,15.24 ADC_LOW2.6 62.18,15.04 62.18,12.6 ADC_LOW1.6 62.38,12.39 62.38,8.94 C5.1
ZRATE  (via drill 0.51)
  Top 0.203: C8.1 72.54,8.94 72.54,12.8 ADC_HIGH1.1 72.34,13.01 72.34,15.24 ADC_HIGH2.1 72.54,15.44 75.18,18.09 75.18,22.96 76.2,23.98 IXZ500_YAW.4 | v42.88,45.52 46.33,42.06 46.33,24.59 v48.77,22.15
  Bottom 0.203: v42.88,45.52 33.53,45.52 33.33,45.72 RAZOR_BACK.8 | v48.77,22.15 74.17,22.15 76,23.98 76.2,23.98 IXZ500_YAW.4

### Text on the board
tPlace: 7 | 6 | 5 | 4 | 3 | 2 | 1 | AeroQuad Shield v2.0 | 3.3V | 3.3V | LED | TX1 | RX1 | GND | SCL | SDA | GND | 12V OUT | www.AeroQuad.info | GPS | LED IN | TX3 | I2C SPARE | 3 | 2 | TX | RX | ARF | GND | 13 | 12 | 11 | 10 | 9 | 8 | 7 | 6 | 5 | 4 | RX3 | TX2 | RX2 | TX1 | RX1 | SDA | SCL | R1 | R2 | SCL | SDA | 3.3V | 3.3V | GND | HMC5843 | ESC | s | + | - | IXZ500 YAW GYRO | 10 | 9 | 8 | 7 | 6 | 5 | 4 | 3 | 2 | 1 | GND | - | + | 3.3V | GND | 3.3V | ZRATE | AZ | GND | s | 5DOF IMU | 3.3V | Y | X | SERVO | RAZOR | DRDY | RST | 5V | GND | GND | VIN | 0 | 1 | 2 | 3 | 4 | 5 | 6 | 7 | 8 | 9 | 10 | 11 | 12 | 13 | 14 | 15 | BAROMETER | CSB | 3V | MISO | MISO | MOSI | + | SCLK | CAPS | 3.3V | 3.3V | AI | GND | 3.3V | SCLK | MOSI | MISO | MISO | SS | - | 5V | GND | R3 | R4 | GND | SPI SPARE